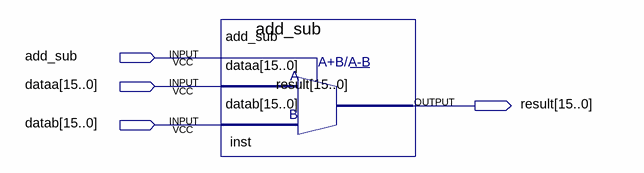
[diagram p0: schematic sheet]
// Quartus schematic lab4_2.bdf as structural Verilog: 1 symbols, 4 pins
module lab4_2 (
  input  add_sub,
  input  [15:0] dataa,
  input  [15:0] datab,
  output [15:0] result
);

  add_sub inst (.add_sub(add_sub), .dataa(dataa), .datab(datab), .result(result));
endmodule
